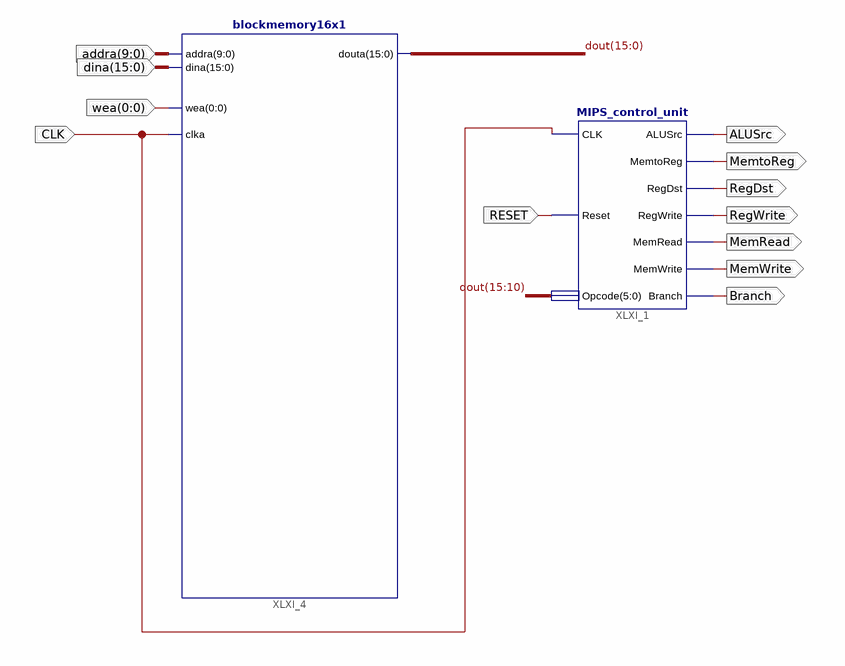
[diagram p0: schematic sheet 1]
// Xilinx ISE schematic ControlandMemory.sch (spartan3e) as structural Verilog: 2 symbols, 12 ports
module ControlandMemory (
  input  CLK,
  input  RESET,
  input  [9:0] addra,
  input  [15:0] dina,
  input  [0:0] wea,
  output ALUSrc,
  output MemtoReg,
  output RegDst,
  output RegWrite,
  output MemRead,
  output MemWrite,
  output Branch
);

  wire [15:0] dout;

  MIPS_control_unit XLXI_1 (
    .CLK(CLK), .Reset(RESET), .Opcode(dout[15:10]), .ALUSrc(ALUSrc), .MemtoReg(MemtoReg), .RegDst(RegDst),
    .RegWrite(RegWrite), .MemRead(MemRead), .MemWrite(MemWrite), .Branch(Branch));
  blockmemory16x1 XLXI_4 (.addra(addra), .dina(dina), .wea(wea[0]), .clka(CLK), .douta(dout));
endmodule
